# Altium schematic sheet pca10056_sheet2_nrf52840_mcu.SchDoc: PCA10056 - nRF52840 MCU
size A3; Organization: Nordic Semiconductor; DocumentNumber: 2; SheetNumber: 2; SheetTotal: 7; CompanyName: Nordic Semiconductor
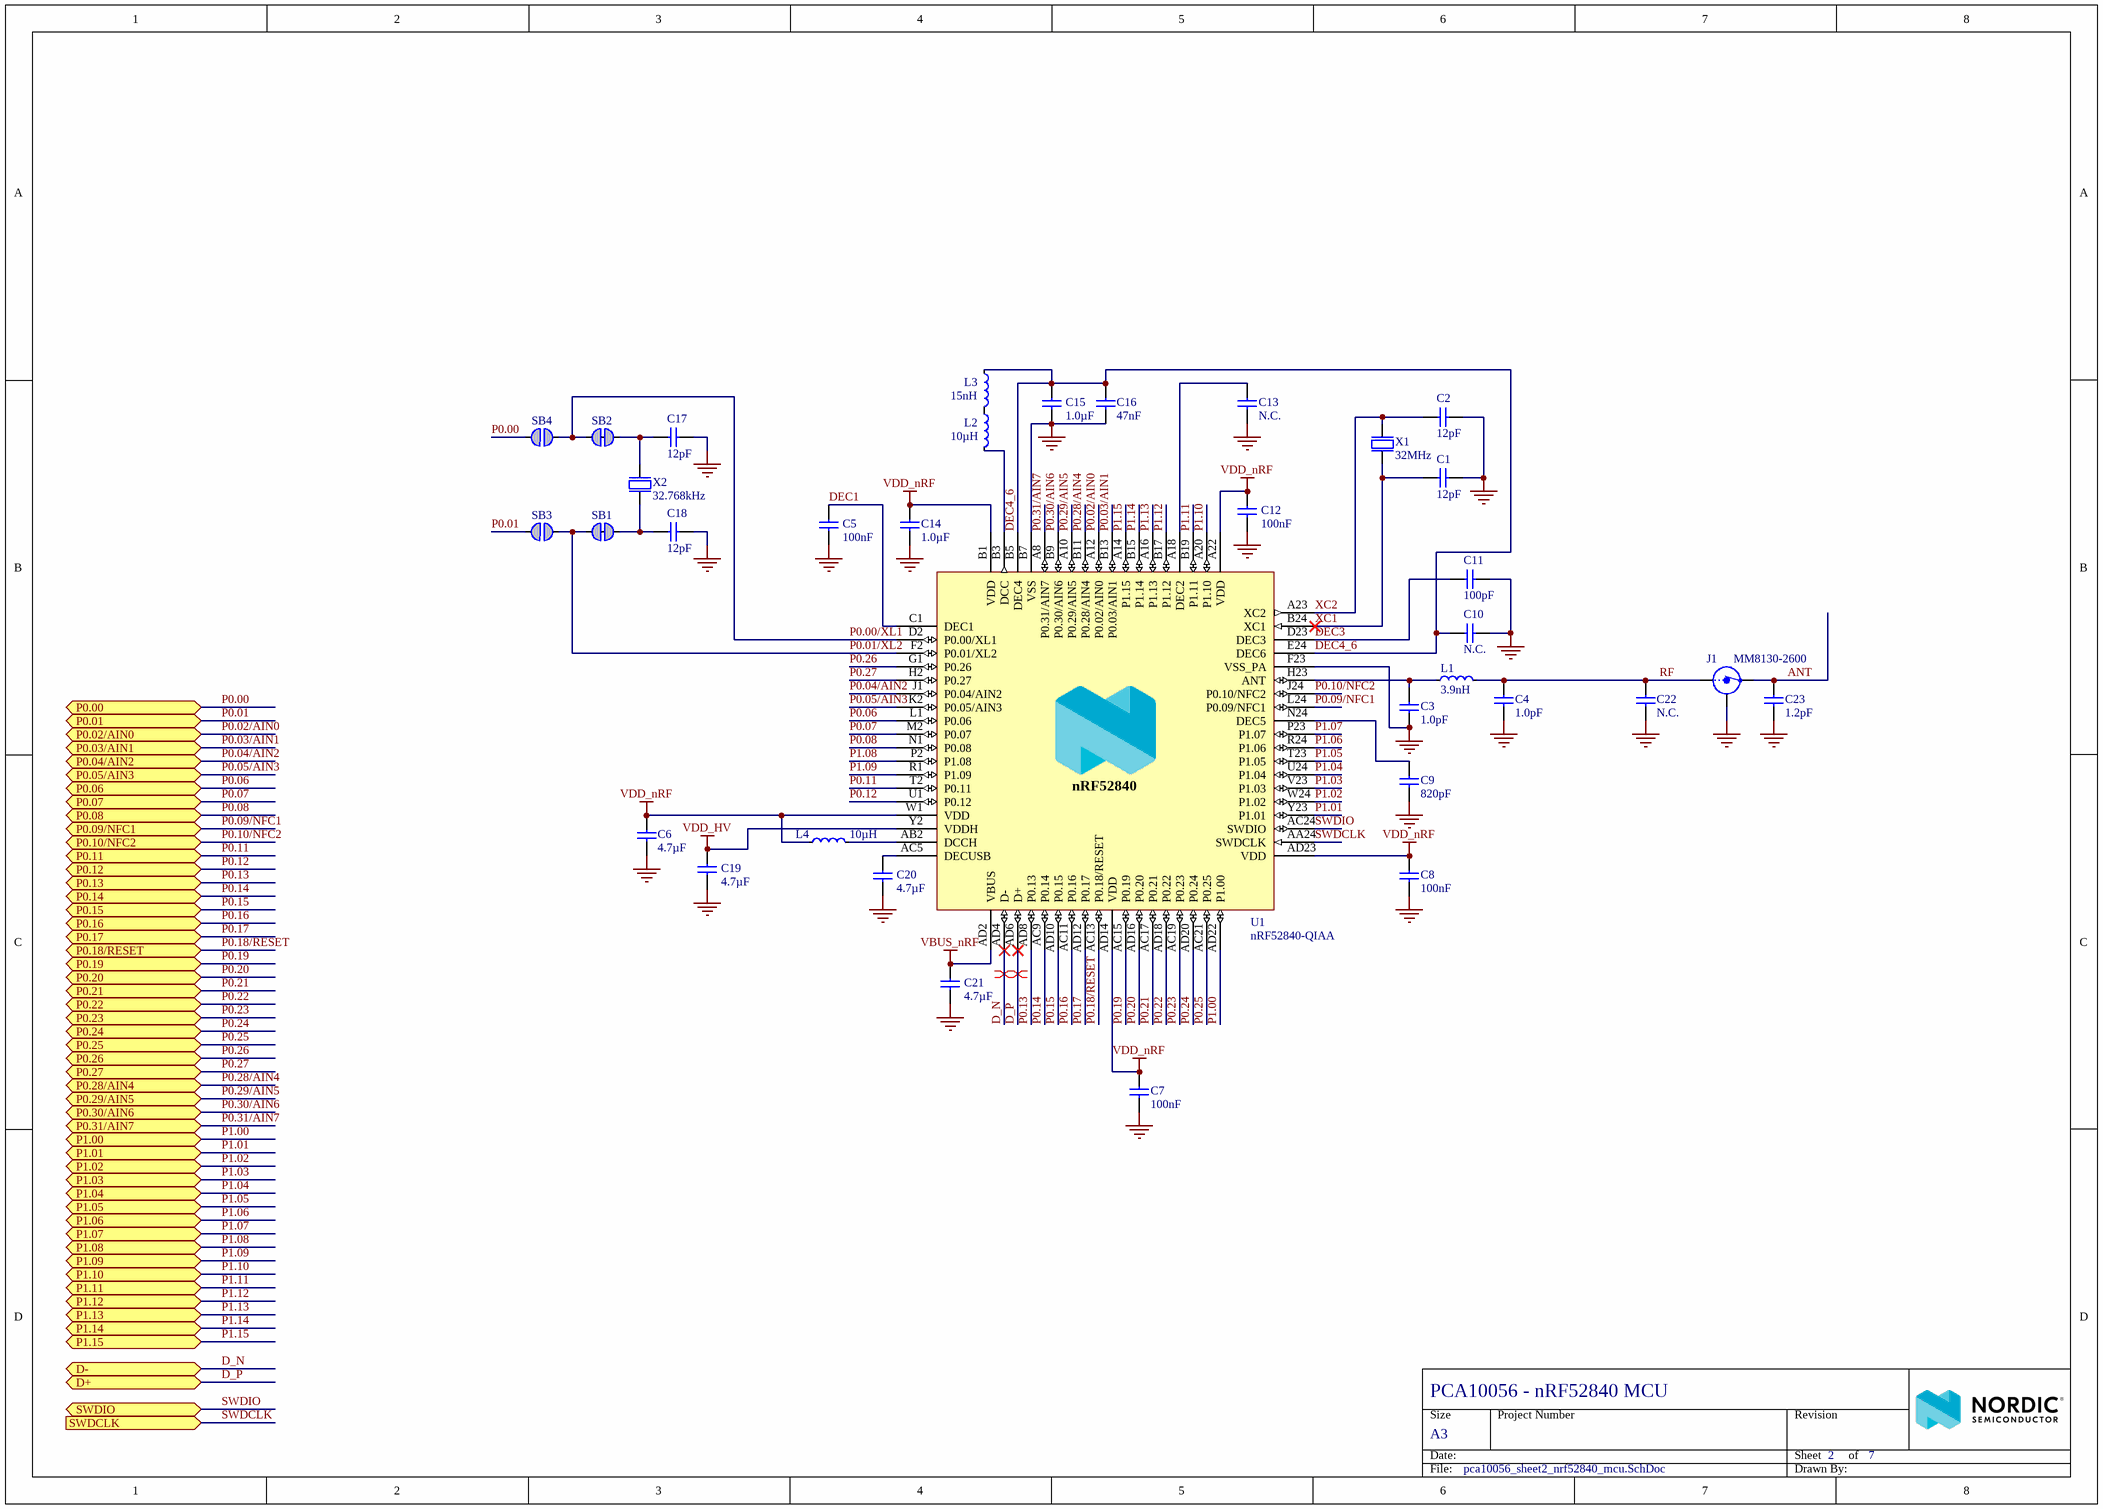
[diagram p0: pca10056_sheet2_nrf52840_mcu.SchDoc]

## Parts
C1  12pF  [CAPC1005X04L]
C2  12pF  [CAPC1005X04L]
C3  1.0pF  [CAPC1005X04L]
C4  1.0pF  [CAPC1005X04L]
C5  100nF  [CAPC1005X04L]
C6  4.7µF  [CAPC1608X06L]
C7  100nF  [CAPC1005X04L]
C8  100nF  [CAPC1005X04L]
C9  820pF  [CAPC1005X04L]
C10  N.C.  [CAPC1005X04L]
C11  100pF  [CAPC1005X04L]
C12  100nF  [CAPC1005X04L]
C13  N.C.  [CAPC1005X04L]
C14  1.0µF  [CAPC1608X06L]
C15  1.0µF  [CAPC1608X06L]
C16  47nF  [CAPC1005X04L]
C17  12pF  [CAPC1005X04L]
C18  12pF  [CAPC1005X04L]
C19  4.7µF  [CAPC1608X06L]
C20  4.7µF  [CAPC1608X06L]
C21  4.7µF  [CAPC1608X06L]
C22  N.C.  [CAPC1005X04L]
C23  1.2pF  [CAPC1005X04L]
J1  MM8130-2600  [COAXIAL-SWF]
L1  3.9nH  [INDC1005X04L]
L2  10µH  [INDC1608X06L]
L3  15nH  [INDC1005X04L]
L4  10µH  [INDC1608X06L]
SB1  Solderbridge  [Solderbridge_Shorted]  (value not drawn)  (net tie, no BOM)
SB2  Solderbridge  [Solderbridge_Shorted]  (value not drawn)  (net tie, no BOM)
SB3  Solderbridge  [Solderbridge]  (value not drawn)  (no BOM)
SB4  Solderbridge  [Solderbridge]  (value not drawn)  (no BOM)
U1  nRF52840-QIAA  [AQFN50P700X700X85_HS-74N]
X1  32MHz  [BT-XTAL_2016]
X2  32.768kHz  [XTAL_3215]

## Ports
D+ (bidir), D- (bidir), P0.00 (bidir), P0.01 (bidir), P0.02/AIN0 (bidir), P0.03/AIN1 (bidir), P0.04/AIN2 (bidir), P0.05/AIN3 (bidir), P0.06 (bidir), P0.07 (bidir), P0.08 (bidir), P0.09/NFC1 (bidir), P0.10/NFC2 (bidir), P0.11 (bidir), P0.12 (bidir), P0.13 (bidir), P0.14 (bidir), P0.15 (bidir), P0.16 (bidir), P0.17 (bidir), P0.18/RESET (bidir), P0.19 (bidir), P0.20 (bidir), P0.21 (bidir), P0.22 (bidir), P0.23 (bidir), P0.24 (bidir), P0.25 (bidir), P0.26 (bidir), P0.27 (bidir), P0.28/AIN4 (bidir), P0.29/AIN5 (bidir), P0.30/AIN6 (bidir), P0.31/AIN7 (bidir), P1.00 (bidir), P1.01 (bidir), P1.02 (bidir), P1.03 (bidir), P1.04 (bidir), P1.05 (bidir), P1.06 (bidir), P1.07 (bidir), P1.08 (bidir), P1.09 (bidir), P1.10 (bidir), P1.11 (bidir), P1.12 (bidir), P1.13 (bidir), P1.14 (bidir), P1.15 (bidir), SWDCLK (in), SWDIO (bidir)

## Nets
GND: C1.2 C2.2 C3.1 C4.1 C5.2 C6.2 C7.2 C8.2 C9.2 C10.1 C11.2 C12.2 C13.2 C14.2 C15.1 C16.2 C17.1 C18.1 C19.2 C20.2 C21.2 C22.2 C23.2 J1.2(Shield) U1.74(GND) U1.B7(VSS) U1.F23(VSS_PA) X1.2(GND) X1.4(GND)
VBUS_nRF: C21.1 U1.AD2(VBUS)
VDD_HV: C19.1 U1.Y2(VDDH)
VDD_nRF: C6.1 C7.1 C8.1 C12.1 C14.1 L4.1 U1.A22(VDD) U1.AD14(VDD) U1.AD23(VDD) U1.B1(VDD) U1.W1(VDD)
ANT: C23.1 J1.3(OUT)
D_N: U1.AD4(D-) ; port D-
D_P: U1.AD6(D+) ; port D+
DEC1: C5.1 U1.C1(DEC1)
DEC3: C11.1 U1.D23(DEC3)
DEC4_6: C10.2 C15.2 C16.1 L3.1 U1.B5(DEC4) U1.E24(DEC6)
P0.00: SB4.2 ; port P0.00
P0.00/XL1: SB2.2 SB4.1 U1.D2(P0.00/XL1)
P0.01: SB3.2 ; port P0.01
P0.01/XL2: SB1.2 SB3.1 U1.F2(P0.01/XL2)
P0.02/AIN0: U1.A12(P0.02/AIN0) ; port P0.02/AIN0
P0.03/AIN1: U1.B13(P0.03/AIN1) ; port P0.03/AIN1
P0.04/AIN2: U1.J1(P0.04/AIN2) ; port P0.04/AIN2
P0.05/AIN3: U1.K2(P0.05/AIN3) ; port P0.05/AIN3
P0.06: U1.L1(P0.06) ; port P0.06
P0.07: U1.M2(P0.07) ; port P0.07
P0.08: U1.N1(P0.08) ; port P0.08
P0.09/NFC1: U1.L24(P0.09/NFC1) ; port P0.09/NFC1
P0.10/NFC2: U1.J24(P0.10/NFC2) ; port P0.10/NFC2
P0.11: U1.T2(P0.11) ; port P0.11
P0.12: U1.U1(P0.12) ; port P0.12
P0.13: U1.AD8(P0.13) ; port P0.13
P0.14: U1.AC9(P0.14) ; port P0.14
P0.15: U1.AD10(P0.15) ; port P0.15
P0.16: U1.AC11(P0.16) ; port P0.16
P0.17: U1.AD12(P0.17) ; port P0.17
P0.18/RESET: U1.AC13(P0.18/RESET) ; port P0.18/RESET
P0.19: U1.AC15(P0.19) ; port P0.19
P0.20: U1.AD16(P0.20) ; port P0.20
P0.21: U1.AC17(P0.21) ; port P0.21
P0.22: U1.AD18(P0.22) ; port P0.22
P0.23: U1.AC19(P0.23) ; port P0.23
P0.24: U1.AD20(P0.24) ; port P0.24
P0.25: U1.AC21(P0.25) ; port P0.25
P0.26: U1.G1(P0.26) ; port P0.26
P0.27: U1.H2(P0.27) ; port P0.27
P0.28/AIN4: U1.B11(P0.28/AIN4) ; port P0.28/AIN4
P0.29/AIN5: U1.A10(P0.29/AIN5) ; port P0.29/AIN5
P0.30/AIN6: U1.B9(P0.30/AIN6) ; port P0.30/AIN6
P0.31/AIN7: U1.A8(P0.31/AIN7) ; port P0.31/AIN7
P1.00: U1.AD22(P1.00) ; port P1.00
P1.01: U1.Y23(P1.01) ; port P1.01
P1.02: U1.W24(P1.02) ; port P1.02
P1.03: U1.V23(P1.03) ; port P1.03
P1.04: U1.U24(P1.04) ; port P1.04
P1.05: U1.T23(P1.05) ; port P1.05
P1.06: U1.R24(P1.06) ; port P1.06
P1.07: U1.P23(P1.07) ; port P1.07
P1.08: U1.P2(P1.08) ; port P1.08
P1.09: U1.R1(P1.09) ; port P1.09
P1.10: U1.A20(P1.10) ; port P1.10
P1.11: U1.B19(P1.11) ; port P1.11
P1.12: U1.B17(P1.12) ; port P1.12
P1.13: U1.A16(P1.13) ; port P1.13
P1.14: U1.B15(P1.14) ; port P1.14
P1.15: U1.A14(P1.15) ; port P1.15
RF: C4.2 C22.1 J1.1(IN) L1.2
SWDCLK: U1.AA24(SWDCLK) ; port SWDCLK
SWDIO: U1.AC24(SWDIO) ; port SWDIO
XC1: C1.1 U1.B24(XC1) X1.1(inp)
XC2: C2.1 U1.A23(XC2) X1.3(out)
NetC3_2: C3.2 L1.1 U1.H23(ANT)
NetC9_1: C9.1 U1.N24(DEC5)
NetC13_1: C13.1 U1.A18(DEC2)
NetC17_2: C17.2 SB2.1 X2.1(inp)
NetC18_2: C18.2 SB1.1 X2.2(out)
NetC20_1: C20.1 U1.AC5(DECUSB)
NetL2_1: L2.1 L3.2
NetL2_2: L2.2 U1.B3(DCC)
NetL4_2: L4.2 U1.AB2(DCCH)

## Layout directives
differential pair: D_N, D_P

## Notes on the sheet
- Size
- Date:
- A3
- Project Number
- Sheet         of
- Revision
- File:
- Drawn By:
- (in symbol nRF52840-QIAAC0) nRF52840

## Library data of the parts
C1 C2 C17 C18 = C0402-12p: Capacitor, NP0, ±2%; Part number IPS: 00000002398; Note: 50V; Artikkelnr Noca: 20029159; Artikkelnr Simpro: N.A.; Part Number: C0402-12p; LatestRevisionDate: 2011-05-11; Pin Count: 2; Publisher: Nordic Semiconductor; Published: 2009-05-08; Value: 12pF; Footprint Doc: 0402; Manufacturer: *; Manufacturer Part Number: *; Datasheet: *; Supplier: *; Supplier part number: *; 2nd source Supplier: *; 2nd source part number: *
C3 C4 = C0402-1.0p: Capacitor, NP0, ±0.1pF; Note: 50V; Artikkelnr Noca: 20029140; Artikkelnr Simpro: N.A.; Part Number: C0402-1.0p; LatestRevisionDate: 2017-02-23; Pin Count: 2; Publisher: Nordic Semiconductor; Published: 2009-05-08; Value: 1.0pF; Footprint Doc: 0402; Manufacturer: *; Manufacturer Part Number: *; Datasheet: *; Supplier: Digi-Key; Supplier part number: 490-6073-1-ND; 2nd source Supplier: *; 2nd source part number: *
C5 C7 C8 C12 = C0402-100n: Capacitor, X7R, ±10%; Part number IPS: 00000005296; Note: 16V; Artikkelnr Noca: 20039200; Artikkelnr Simpro: N.A.; Part Number: C0402-100n; LatestRevisionDate: 2009-11-23; Pin Count: 2; Publisher: Nordic Semiconductor; Published: 2009-05-08; Value: 100nF; Footprint Doc: 0402; Manufacturer: *; Manufacturer Part Number: *; Datasheet: *; Supplier: *; Supplier part number: *; 2nd source Supplier: *; 2nd source part number: *
C6 C20 = C0603-4µ7-6.3V-X7R: Capacitor, X7R, ±10%; Manufacturer: Samsung; Manufacturer Part Number: CL10B475KQ8NQNC; Note: 6.3V; Artikkelnr Noca: 20039473; Artikkelnr Simpro: N.A.; Part Number: C0603-4µ7-6.3V-X7R; LatestRevisionDate: 2015-06-10; Pin Count: 2; Publisher: Nordic Semiconductor; Published: 2015-06-10; Value: 4.7µF; Footprint Doc: 0603; Datasheet: http://media.digikey.com/pdf/Data%20Sheets/Samsung%20PDFs/CL10B475KQ8NQNC_Spec.pdf; Supplier: Digi-Key; Supplier part number: 1276-2087-1-ND; 2nd source Supplier: *; 2nd source part number: *
C9 = C0402-820p: Capacitor, NP0, ±5%; Note: 50V; Artikkelnr Noca: 20029219; Artikkelnr Simpro: N.A.; Part Number: C0402-820p; LatestRevisionDate: 2009-05-08; Pin Count: 2; Publisher: Nordic Semiconductor; Published: 2009-05-08; Value: 820pF; Footprint Doc: 0402; Manufacturer: *; Manufacturer Part Number: *; Datasheet: *; Supplier: *; Supplier part number: *; 2nd source Supplier: *; 2nd source part number: *
C10 C13 = C0402-N.C.: Not mounted; Note: Chip Cap; Assembly: Not mounted; Artikkelnr Noca: N.A.; Part Number: C0402-N.C.; LatestRevisionDate: 2009-05-08; Pin Count: 2; Publisher: Nordic Semiconductor; Published: 2009-05-08; Value: N.C.; Footprint Doc: 0402; Manufacturer: *; Manufacturer Part Number: *; Datasheet: *; Supplier: *; Supplier part number: *; 2nd source Supplier: *; 2nd source part number: *; Artikkelnr Simpro: N.A.
C11 = C0402-100p: Capacitor, NP0, ±5%; Part number IPS: 00000002361; Note: 50V; Artikkelnr Noca: 20029135; Artikkelnr Simpro: N.A.; Part Number: C0402-100p; LatestRevisionDate: 2009-05-08; Pin Count: 2; Publisher: Nordic Semiconductor; Published: 2009-05-08; Value: 100pF; Footprint Doc: 0402; Manufacturer: *; Manufacturer Part Number: *; Datasheet: *; Supplier: *; Supplier part number: *; 2nd source Supplier: *; 2nd source part number: *
C14 C15 = C0603-1µ0: Capacitor, X7R, ±10%; Part number IPS: 00000000616; Note: 16V; Artikkelnr Noca: 20039335; Artikkelnr Simpro: N.A.; Part Number: C0603-1µ0; LatestRevisionDate: 2013-06-05; Pin Count: 2; Publisher: Nordic Semiconductor; Published: 2009-05-08; Value: 1.0µF; Footprint Doc: 0603; Manufacturer: *; Manufacturer Part Number: *; Datasheet: *; Supplier: *; Supplier part number: *; 2nd source Supplier: *; 2nd source part number: *
C16 = C0402-47n: Capacitor, X7R, ±10%; Note: Chip Cap 10%; Artikkelnr Noca: 20039389; Artikkelnr Simpro: N.A.; Part Number: C0402-47n; LatestRevisionDate: 2009-05-08; Pin Count: 2; Publisher: Nordic Semiconductor; Published: 2009-05-08; Value: 47nF; Footprint Doc: 0402; Manufacturer: *; Manufacturer Part Number: *; Datasheet: *; Supplier: *; Supplier part number: *; 2nd source Supplier: *; 2nd source part number: *
C19 C21 = C0603-4µ7-10V-X7S: Capacitor, X7S, ±10%; Note: 10V; Artikkelnr Noca: 20030013; Artikkelnr Simpro: N.A.; Part Number: C0603-4µ7-10V-X7S; LatestRevisionDate: 2016-08-15; Pin Count: 2; Publisher: Nordic Semiconductor; Published: 2016-08-15; Value: 4.7µF; Footprint Doc: 0603; Manufacturer: *; Manufacturer Part Number: *; Datasheet: *; Supplier: Digi-Key; Supplier part number: 445-14258-1-ND; 2nd source Supplier: *; 2nd source part number: *
C22 = C0402-N.C.: Not mounted; Note: Chip Cap; Artikkelnr Noca: N.A.; Assembly: Not mounted; Part Number: C0402-N.C.; Manufacturer: *; Manufacturer Part Number: *; Datasheet: *; LatestRevisionDate: 2009-05-08; Pin Count: 2; Publisher: Nordic Semiconductor; Published: 2009-05-08; Value: N.C.; Supplier: *; Supplier part number: *; 2nd source Supplier: *; 2nd source part number: *; Footprint Doc: 0402; Artikkelnr Simpro: N.A.
C23 = C0402-1.2p: Capacitor, NP0, ±0.1pF; Part number IPS: 00000005410; Note: 50V; Artikkelnr Noca: 20029157; Artikkelnr Simpro: N.A.; Part Number: C0402-1.2p; Manufacturer: *; Manufacturer Part Number: *; Datasheet: *; LatestRevisionDate: 2011-05-11; Pin Count: 2; Publisher: Nordic Semiconductor; Published: 2009-05-08; Value: 1.2pF; Supplier: *; Supplier part number: *; 2nd source Supplier: *; 2nd source part number: *; Footprint Doc: 0402
J1 = MM8130-2600: Coaxial Connector with Switch; Manufacturer: Murata; 2nd source part number: 81-MM8130-2600RA2; Artikkelnr Noca: 55029011; Artikkelnr Simpro: N.A.; Part Number: MM8130-2600; Manufacturer Part Number: MM8130-2600; Datasheet: http://www.murata.com/products/catalog/pdf/o33e.pdf; LatestRevisionDate: 2014-04-24; Pin Count: 3; Publisher: Nordic Semiconductor; Published: 2014-04-24; Value: MM8130-2600; Note: *; Supplier: Digi-Key; Supplier part number: 490-4981-1-ND; 2nd source Supplier: Mouser; Footprint Doc: COAXIAL-SWF
L1 = L0402-3n9: Inductor, 170mA, ±0.1nH; Manufacturer: Murata; Manufacturer Part Number: LQP15MN3N9B02D; Part number IPS: 00000007793; Note: High frequency chip inductor ±5%; Artikkelnr Noca: 33029151; Artikkelnr Simpro: N.A.; Part Number: L0402-3n9; LatestRevisionDate: 2012-09-19; Pin Count: 2; Publisher: Nordic Semiconductor; Published: 2009-05-08; Value: 3.9nH; Footprint Doc: 0402; ComponentLink1Description: Datasheet; ComponentLink2Description: Supplier link; Datasheet: http://search.murata.co.jp/Ceramy/image/img/PDF/ENG/L0075S0084LQP15M.pdf; Supplier: Digi-Key; Supplier part number: 490-1131-1-ND; 2nd source Supplier: *; 2nd source part number: *
L2 L4 = L0603-10µ: Inductor, 80mA, ±10%; Manufacturer: Taiyo Yuden; Manufacturer Part Number: LBMF1608T100K; 2nd source part number: 178-6105; Part number IPS: 00000007794; Note: LBMF1608T100K 10µH 80mA 0603; Artikkelnr Noca: 33029314; Artikkelnr Simpro: N.A.; Part Number: L0603-10µ; LatestRevisionDate: 2012-09-19; Pin Count: 2; Publisher: Nordic Semiconductor; Published: 2010-02-24; Value: 10µH; Footprint Doc: 0603; ComponentLink1Description: Datasheet; ComponentLink2Description: Supplier link; Datasheet: http://www.yuden.co.jp/ut/product/pdf/elb2_e.pdf; Supplier: Digi-Key; Supplier part number: 587-1714-1-ND; 2nd source Supplier: Farnell
L3 = L0402-15n: Inductor, 320mA, ±5%; Manufacturer: Taiyo Yuden; Manufacturer Part Number: HK100515NJ-T; 2nd source part number: 658-1328; Part number IPS: 00000003215; Note: High frequency chip inductor ±10%; Artikkelnr Noca: 33029323; Artikkelnr Simpro: N.A.; Part Number: L0402-15n; LatestRevisionDate: 2012-09-19; Pin Count: 2; Publisher: Nordic Semiconductor; Published: 2010-07-12; Value: 15nH; Footprint Doc: 0402; ComponentLink1Description: Datasheet; ComponentLink2Description: Supplier link; Datasheet: http://www.yuden.co.jp/productdata/catalog/en/mlci04_e.pdf; Supplier: Digi-Key; Supplier part number: 587-1521-1-ND; 2nd source Supplier: Farnell
SB1 SB2 = Solderbridge Shorted: Shorted Solderbridge; Artikkelnr Noca: N.A.; Part Number: Solderbridge Shorted; Manufacturer: *; Manufacturer Part Number: *; Datasheet: *; LatestRevisionDate: 2012-08-07; Pin Count: 2; Publisher: Nordic Semiconductor; Published: 2012-08-07; Value: Solderbridge; Note: *; Supplier: *; Supplier part number: *; 2nd source Supplier: *; 2nd source part number: *; Footprint Doc: Solderbridge_Shorted; Artikkelnr Simpro: N.A.
SB3 SB4 = Solderbridge: Artikkelnr Noca: N.A.; Part Number: Solderbridge; Manufacturer: *; Manufacturer Part Number: *; Datasheet: *; LatestRevisionDate: 2009-12-14; Pin Count: 2; Publisher: Nordic Semiconductor; Published: 2009-12-14; Value: Solderbridge; Note: *; Supplier: *; Supplier part number: *; 2nd source Supplier: *; 2nd source part number: *; Footprint Doc: Solderbridge; Artikkelnr Simpro: N.A.
U1 = nRF52840-QIAAC0: Multi-protocol Bluetooth Low Energy, IEEE 802.15.4, ANT and 2.4GHz proprietary system-on-chip; Manufacturer: Nordic Semiconductor; Artikkelnr Noca: 15079380; Artikkelnr Simpro: N.A.; Part Number: nRF52840-QIAAC0; Manufacturer Part Number: nRF52840-QIAAC0; LatestRevisionDate: 2018-02-27; Pin Count: 73; Publisher: Nordic Semiconductor; Published: 2017-08-21; Value: nRF52840-QIAA; Note: *; Supplier: Nordic Semiconductor; Supplier part number: nRF52840-QIAAC0; 2nd source Supplier: *; 2nd source part number: *; Footprint Doc: AQFN-73; Part number IPS: N.A.; ComponentLink1URL: *; ComponentLink1Description: Datasheet; ComponentLink2URL: *; ComponentLink2Description: Supplier link; HelpURL: *
X1 = XTAL_SMD2016_32MHz_8pF_Golledge: XTAL SMD 2016, 32MHz, Cl=8pF, Tol: ±10ppm, Stab: ±15ppm; Manufacturer Part Number: MP06003; Note: XTAL SMD 32.000MHz; Artikkelnr Noca: N.A.; Part Number: XTAL_SMD2016_32MHz_8pF_Golledge; LatestRevisionDate: 2016-11-02; Pin Count: 4; Publisher: Nordic Semiconductor; Published: 2016-11-02; Value: 32MHz; Footprint Doc: XTAL_2016; Manufacturer: Golledge; Supplier: Link Nordic; Supplier part number: *; 2nd source Supplier: *; 2nd source part number: *; Artikkelnr Simpro: N.A.; ComponentLink1URL: *; ComponentLink1Description: Datasheet; ComponentLink2URL: *; ComponentLink2Description: Supplier link; HelpURL: \\hizz\pro\app9717\Datasheet\crystals\Golledge\mp06003.pdf
X2 = XTAL_SMD3215_32.768kHz_9pF_NDK: XTAL SMD 2012, 32.768kHz, 9pF, ±20ppm; Manufacturer: NDK; Manufacturer Part Number: NX3215SA-32.768K-STD-MUA-9; Note: XTAL SMD 32.768kHz; Artikkelnr Noca: N.A.; Part Number: XTAL_SMD3215_32.768kHz_9pF_NDK; Datasheet: *; LatestRevisionDate: 2017-10-23; Pin Count: 2; Publisher: Nordic Semiconductor; Published: 2017-10-23; Value: 32.768kHz; Supplier: *; Supplier part number: *; 2nd source Supplier: *; 2nd source part number: *; Footprint Doc: XTAL_3215; Artikkelnr Simpro: N.A.